# EAGLE design battery-voltage-current-sensor (EAGLE 9.6.2)
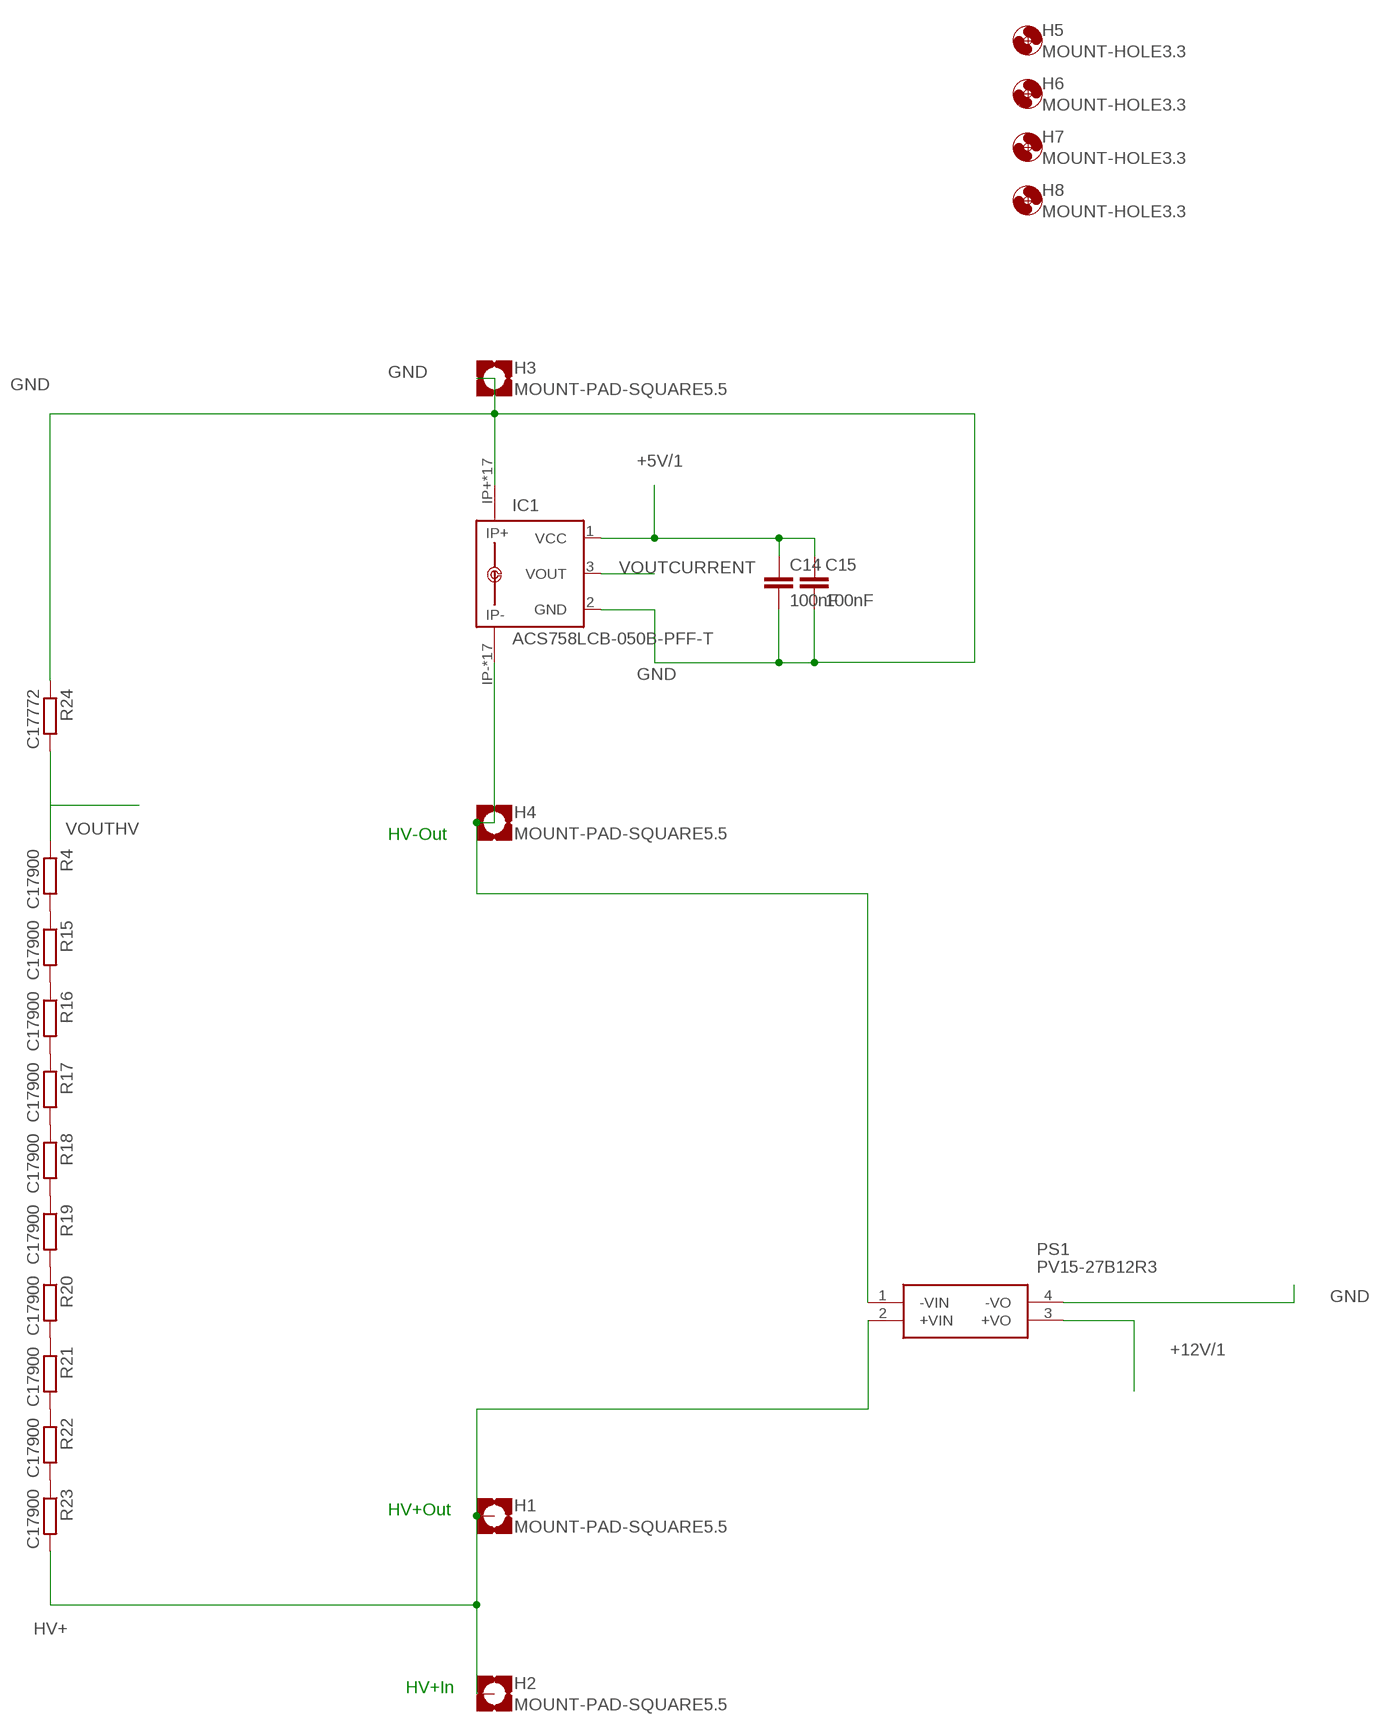
[diagram p0: schematic, sheet 1, part 1 of 2]
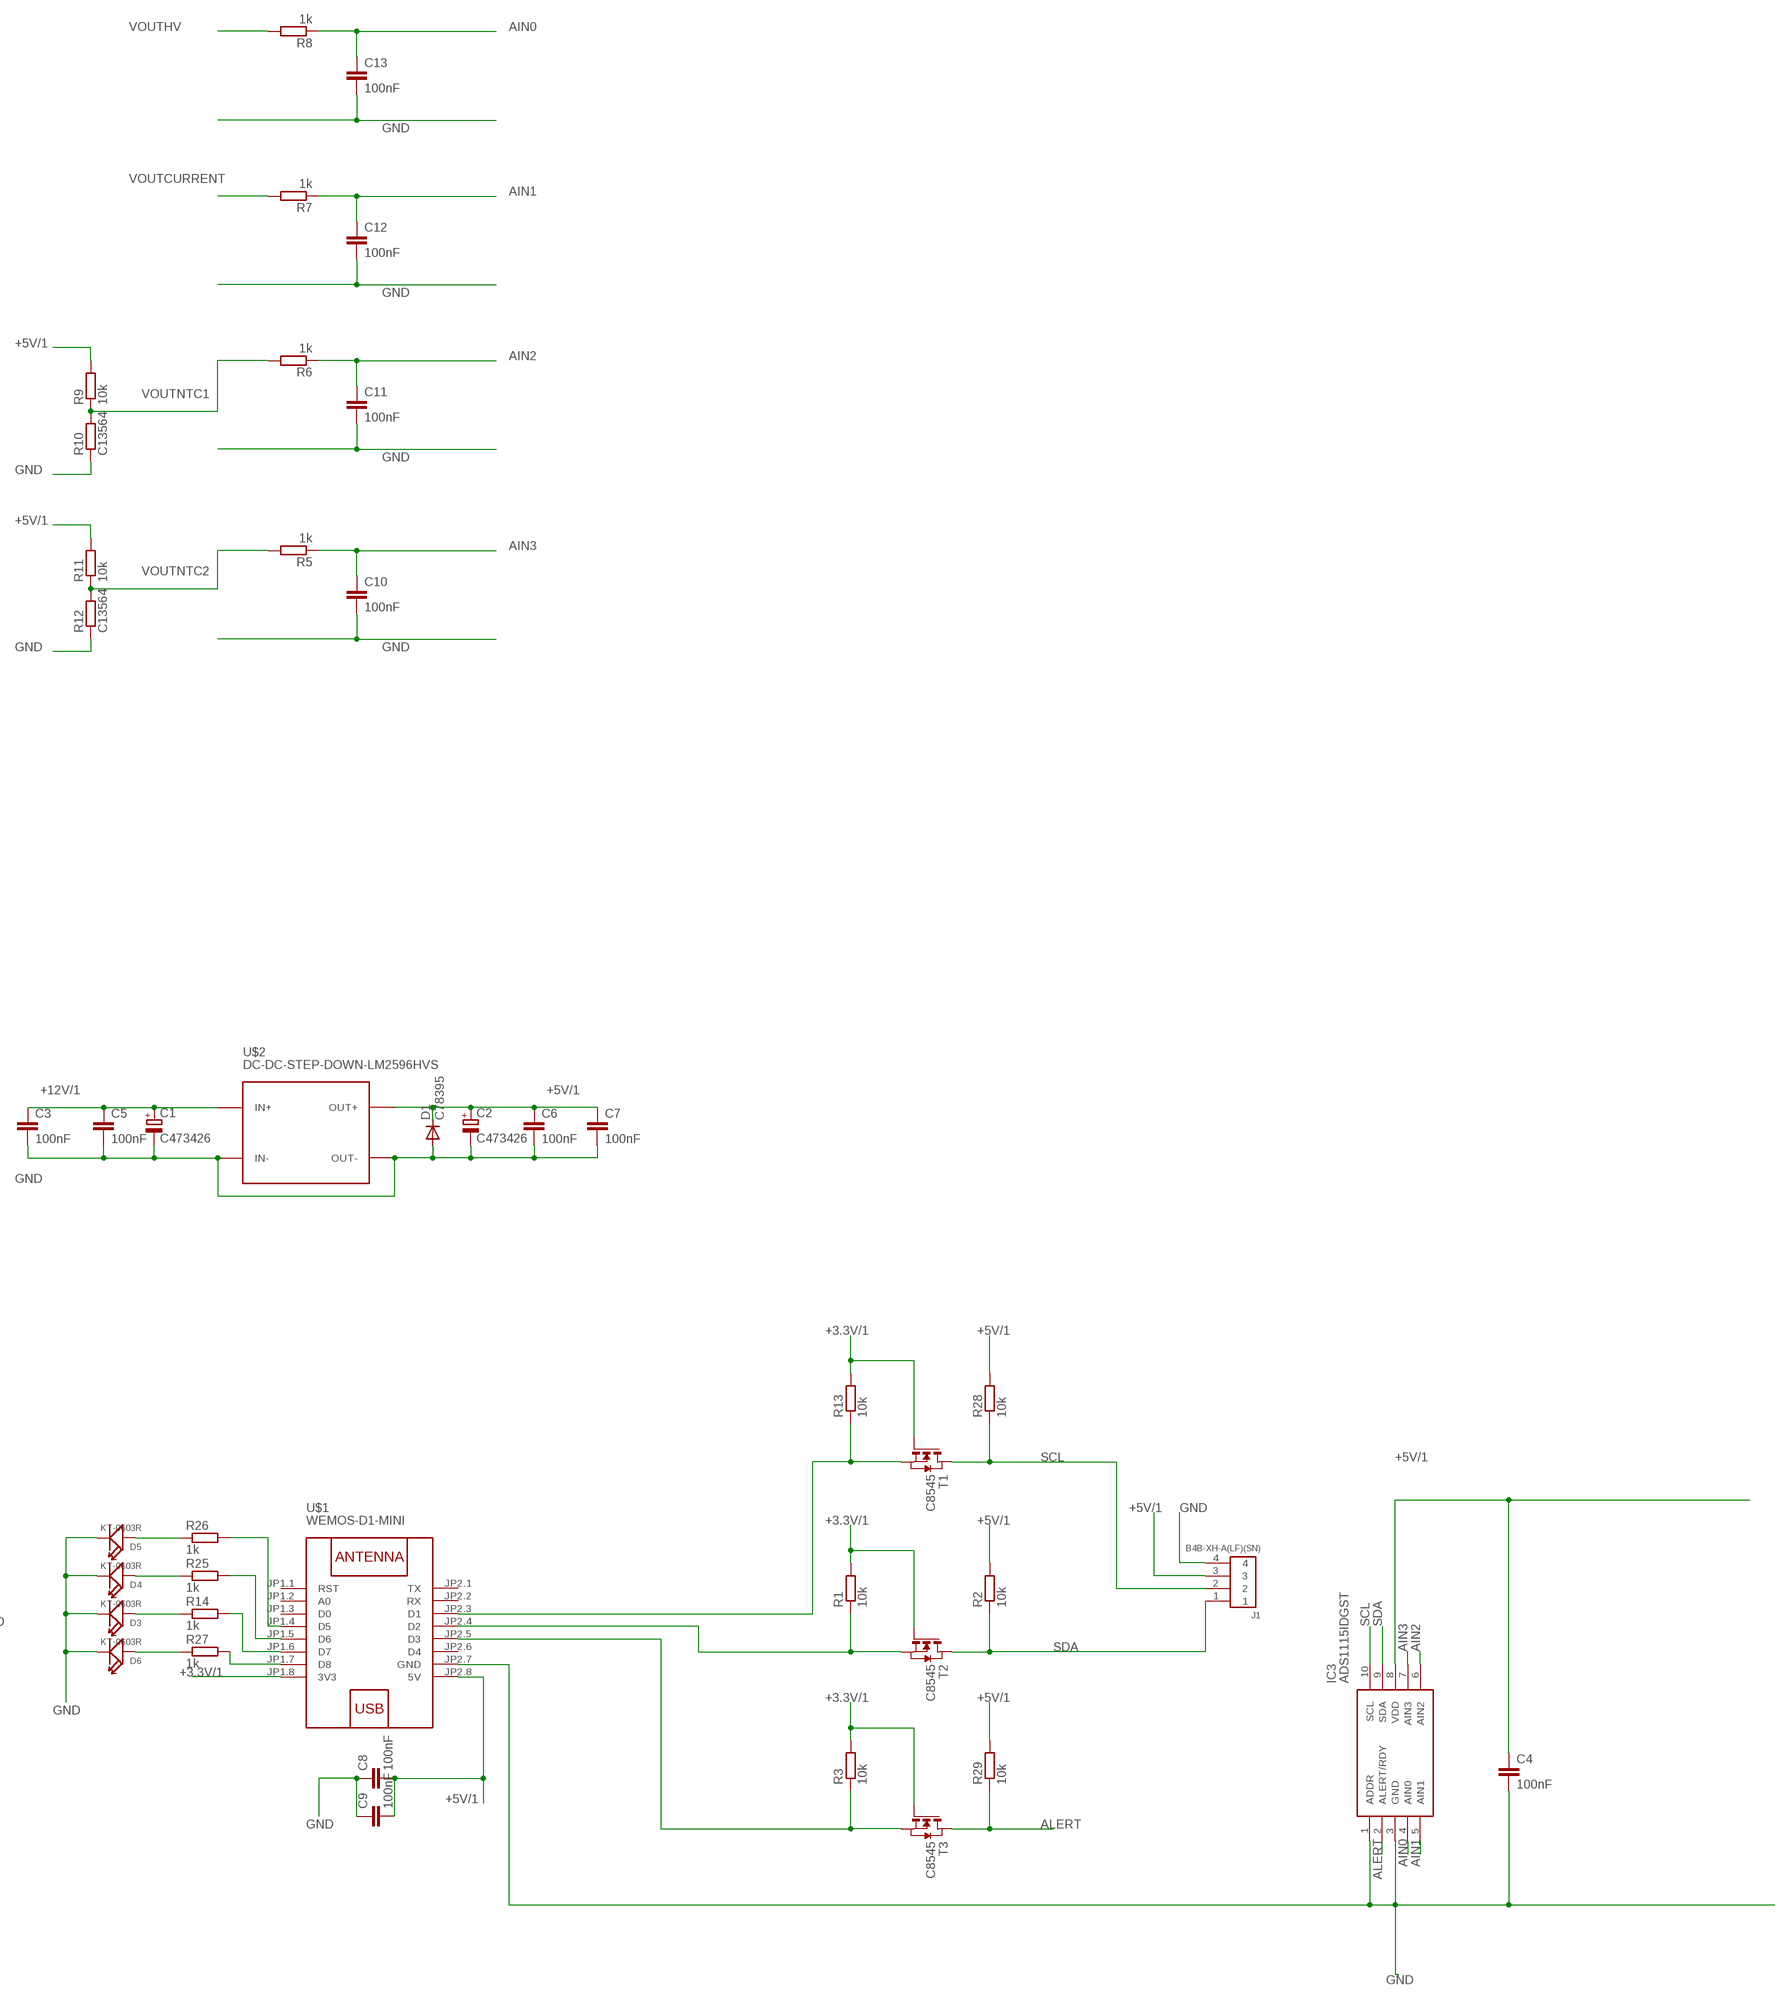
[diagram p1: schematic, sheet 1, part 2 of 2]

## Parts
C1  C473426  CPOL-EUUD-6,3X7,7  [UD-6,3X7,7_NICHICON]
C2  C473426  CPOL-EUUD-6,3X7,7  [UD-6,3X7,7_NICHICON]
C3  100nF  C-EUC0603  [C0603]
C4  100nF  C-EUC0805  [C0805]
C5  100nF  C-EUC0603  [C0603]
C6  100nF  C-EUC0603  [C0603]
C7  100nF  C-EUC0603  [C0603]
C8  100nF  C-EUC0603  [C0603]
C9  100nF  C-EUC0603  [C0603]
C10  100nF  C-EUC0603  [C0603]
C11  100nF  C-EUC0603  [C0603]
C12  100nF  C-EUC0603  [C0603]
C13  100nF  C-EUC0603  [C0603]
C14  100nF  C-EUC0603  [C0603]
C15  100nF  C-EUC0603  [C0603]
D1  C78395  DIODE-SMB  [SMB]
D3  KT-0603R  SMD-LED-CLEAR-BLUE(0603)  [LED-0603]
D4  KT-0603R  SMD-LED-CLEAR-BLUE(0603)  [LED-0603]
D5  KT-0603R  SMD-LED-CLEAR-BLUE(0603)  [LED-0603]
D6  KT-0603R  SMD-LED-CLEAR-BLUE(0603)  [LED-0603]
H1  MOUNT-PAD-SQUARE5.5  [5,5-PAD-SQUARE]
H2  MOUNT-PAD-SQUARE5.5  [5,5-PAD-SQUARE]
H3  MOUNT-PAD-SQUARE5.5  [5,5-PAD-SQUARE]
H4  MOUNT-PAD-SQUARE5.5  [5,5-PAD-SQUARE]
H5  MOUNT-HOLE3.3  [3,3]
H6  MOUNT-HOLE3.3  [3,3]
H7  MOUNT-HOLE3.3  [3,3]
H8  MOUNT-HOLE3.3  [3,3]
IC1  ACS758LCB-050B-PFF-T  [CB-PFF]
IC3  ADS1115IDGST  [SOP50P490X110-10N]
J1  B4B-XH-A(LF)(SN)  [B4B-XH-A(LF)(SN)]
PS1  PV15-27B12R3  [PV1527B12R3]
R1  10k  R-EU_R0603  [R0603]
R2  10k  R-EU_R0603  [R0603]
R3  10k  R-EU_R0603  [R0603]
R4  C17900  R-EU_R1206  [R1206]
R5  1k  R-EU_R0805  [R0805]
R6  1k  R-EU_R0805  [R0805]
R7  1k  R-EU_R0805  [R0805]
R8  1k  R-EU_R0805  [R0805]
R9  10k  R-EU_R0603  [R0603]
R10  C13564  R-EU_R0603  [R0603]
R11  10k  R-EU_R0603  [R0603]
R12  C13564  R-EU_R0603  [R0603]
R13  10k  R-EU_R0603  [R0603]
R14  1k  R-EU_R0805  [R0805]
R15  C17900  R-EU_R1206  [R1206]
R16  C17900  R-EU_R1206  [R1206]
R17  C17900  R-EU_R1206  [R1206]
R18  C17900  R-EU_R1206  [R1206]
R19  C17900  R-EU_R1206  [R1206]
R20  C17900  R-EU_R1206  [R1206]
R21  C17900  R-EU_R1206  [R1206]
R22  C17900  R-EU_R1206  [R1206]
R23  C17900  R-EU_R1206  [R1206]
R24  C17772  R-EU_R0805  [R0805]
R25  1k  R-EU_R0805  [R0805]
R26  1k  R-EU_R0805  [R0805]
R27  1k  R-EU_R0805  [R0805]
R28  10k  R-EU_R0603  [R0603]
R29  10k  R-EU_R0603  [R0603]
T1  C8545  NMOSSOT23  [SOT-23]
T2  C8545  NMOSSOT23  [SOT-23]
T3  C8545  NMOSSOT23  [SOT-23]
U$1  WEMOS-D1-MINI  [WEMOS-D1-MINI]
U$2  DC-DC-STEP-DOWN-LM2596HVS  [DC-DC-STEP-DOWN-LM2596HVS]

## Nets
+3.3V/1: R1.2 R3.2 R13.2 T1.3(G) T2.3(G) T3.3(G) U$1.JP1.8(3V3)
+5V/1: C2.+ C4.1 C6.1 C7.1 C8.2 C9.2 C14.1 C15.1 D1.C IC1.1(VCC) IC3.8(VDD) J1.3 R2.2 R9.2 R11.2 R28.2 R29.2 U$1.JP2.8(5V) U$2.OUT+
+12V/1: C1.+ C3.1 C5.1 PS1.3(+VO) U$2.IN+
AIN0: C13.1 IC3.4(AIN0) R8.1
AIN1: C12.1 IC3.5(AIN1) R7.1
AIN2: C11.1 IC3.6(AIN2) R6.1
AIN3: C10.1 IC3.7(AIN3) R5.1
ALERT: IC3.2(ALERT/RDY) R29.1 T3.1(D)
GND: C1.- C2.- C3.2 C4.2 C5.2 C6.2 C7.2 C8.1 C9.1 C10.2 C11.2 C12.2 C13.2 C14.2 C15.2 D1.A D3.- D4.- D5.- D6.- H3.B5,5(MOUNT) IC1.2(GND) IC1.IP+ IC1.IP+@2(IP+) IC1.IP+@3(IP+) IC1.IP+@4(IP+) IC1.IP+@5(IP+) IC1.IP+@6(IP+) IC1.IP+@7(IP+) IC1.IP+@8(IP+) IC1.IP+@9(IP+) IC1.IP+@10(IP+) IC1.IP+@11(IP+) IC1.IP+@12(IP+) IC1.IP+@13(IP+) IC1.IP+@14(IP+) IC1.IP+@15(IP+) IC1.IP+@16(IP+) IC1.IP+@17(IP+) IC3.1(ADDR) IC3.3(GND) J1.4 PS1.4(-VO) R10.1 R12.1 R24.1 U$1.JP2.7(GND) U$2.IN- U$2.OUT-
HV+ [HV]: H1.B5,5(MOUNT) H2.B5,5(MOUNT) PS1.2(+VIN) R23.2
HV- [HV]: H4.B5,5(MOUNT) IC1.IP- IC1.IP-@2(IP-) IC1.IP-@3(IP-) IC1.IP-@4(IP-) IC1.IP-@5(IP-) IC1.IP-@6(IP-) IC1.IP-@7(IP-) IC1.IP-@8(IP-) IC1.IP-@9(IP-) IC1.IP-@10(IP-) IC1.IP-@11(IP-) IC1.IP-@12(IP-) IC1.IP-@13(IP-) IC1.IP-@14(IP-) IC1.IP-@15(IP-) IC1.IP-@16(IP-) IC1.IP-@17(IP-) PS1.1(-VIN)
N$1: R1.1 T2.2(S) U$1.JP2.4(D2)
N$2: R13.1 T1.2(S) U$1.JP2.3(D1)
N$3: D3.+ R14.1
N$5: R3.1 T3.2(S) U$1.JP2.5(D3)
N$6: D4.+ R25.1
N$7: D5.+ R26.1
N$8: R4.2 R15.1
N$9: R15.2 R16.1
N$10: R16.2 R17.1
N$11: R17.2 R18.1
N$12: R18.2 R19.1
N$13: R19.2 R20.1
N$14: R20.2 R21.1
N$15: R21.2 R22.1
N$16: R22.2 R23.1
N$17: D6.+ R27.1
N$18: R27.2 U$1.JP1.7(D8)
N$19: R14.2 U$1.JP1.6(D7)
N$20: R25.2 U$1.JP1.5(D6)
N$21: R26.2 U$1.JP1.4(D5)
SCL: IC3.10(SCL) J1.2 R28.1 T1.1(D)
SDA: IC3.9(SDA) J1.1 R2.1 T2.1(D)
VOUTCURRENT: IC1.3(VOUT) R7.2
VOUTHV: R4.1 R8.2 R24.2
VOUTNTC1: R6.2 R9.1 R10.2
VOUTNTC2: R5.2 R11.1 R12.2
Unconnected: U$1.JP1.1(RST) U$1.JP1.2(A0) U$1.JP1.3(D0) U$1.JP2.1(TX) U$1.JP2.2(RX) U$1.JP2.6(D4)

## Notes on the sheet
- HV-Out
- HV+Out
- HV+In

## Library data of the parts
C1 C2 = rcl:CPOL-EU: POLARIZED CAPACITOR, European symbol
C3-C15 = rcl:C-EU: CAPACITOR, European symbol
D1 = diode:DIODE-: DIODE
D3-D6 = SMD-LED-CLEAR-BLUE_0603_:SMD-LED-CLEAR-BLUE(0603): 304090045 Check prices <https://pricing.snapeda.com/parts/19-217/BHC-ZL1M2RY/3T/Everlight/view-part?ref=eda>; AVAILABILITY: Bad; DESCRIPTION: Blue LED Indication - Discrete 2.8V 0603 (1608 Metric); MF: Everlight; MP: 19-217/BHC-ZL1M2RY/3T; PACKAGE: 0603 Everlight; PRICE: None
H1-H4 = holes:MOUNT-PAD-SQUARE: MOUNTING PAD, square
H5-H8 = holes:MOUNT-HOLE: MOUNTING HOLE with drill center marker
IC1 = allegro:ACS758*: Thermally Enhanced, Fully Integrated, Hall Effect-Based Linear Current Sensor with 100 micro Ohm Current Conductor display layer 49 Reference in BRD and place VIAs on circles Source: http://www.allegromicro.com/en/Products/Part_Numbers/0758/0758.pdf; MPN: ACS758LCB-050B-PFF-T; OC_FARNELL: 1718997; OC_NEWARK: 04R7131
IC3 = SamacSys_Parts:ADS1115IDGST: 16-Bit, 860SPS, 4-Ch Delta-Sigma ADC w/ PGA, Oscillator, Voltage Reference, Comparator & I2C Source: Datasheet <https://datasheet.datasheetarchive.com/originals/distributors/Datasheets-SFU2/DSASFU100025989.pdf>; DESCRIPTION: 16-Bit, 860SPS, 4-Ch Delta-Sigma ADC w/ PGA, Oscillator, Voltage Reference, Comparator & I2C; HEIGHT: 1.1mm; MANUFACTURER_NAME: Texas Instruments; MANUFACTURER_PART_NUMBER: ADS1115IDGST; MOUSER_PART_NUMBER: 595-ADS1115IDGST; MOUSER_PRICE-STOCK: https://www.mouser.co.uk/ProductDetail/Texas-Instruments/ADS1115IDGST?qs=6805eV47HhY3JIwOhQ2zog%3D%3D
J1 = Headers:B4B-XH-A(LF)(SN): CONN HEADER VERT 4POS 2.5MM Manufacturer's datasheet <http://www.jst-mfg.com/product/pdf/eng/eXH.pdf>; CREATED_BY: PCBLayout.com; DIGIKEY_PARTNO: 455-2249-ND; MANUFACTURER: JST Sales America Inc.; MPN: B4B-XH-A(LF)(SN)
PS1 = SamacSys_Parts:PV15-27B12R3: Isolated Module DC DC Converter 1 Output 12V 1.25A 100V - 1000V Input Source: Datasheet <https://www.mornsun-power.com/html/pdf/PV15-27B12R3.html>; DESCRIPTION: Isolated Module DC DC Converter 1 Output 12V 1.25A 100V - 1000V Input; HEIGHT: 24mm; MANUFACTURER_NAME: Mornsun Power; MANUFACTURER_PART_NUMBER: PV15-27B12R3
R1-R29 = rcl:R-EU_: RESISTOR, European symbol
T1-T3 = zetex:NMOSSOT23: MOS FET; OC_FARNELL: unknown; OC_NEWARK: unknown
U$1 = diy-modules:WEMOS-D1-MINI: WEMOS D1 mini: Mini Wi-Fi Board based on ESP-8266 device More details can be found here: https://www.wemos.cc/product/d1-mini.html Click here to find device on ebay.com <http://www.ebay.com/sch/wemos+d1+mini+nodemcu>
U$2 = diy-modules:DC-DC-STEP-DOWN-LM2596HVS: DC/DC Step-Down Regulator based on LM2596-ADJ chip LM2596 datasheet available here: http://www.ti.com/lit/ds/symlink/lm2596.pdf Click here to find device on ebay.com <http://www.ebay.com/sch/lm2596+power+regulator>

## Net classes
1 HV: clearance 0.508 mm

## Board
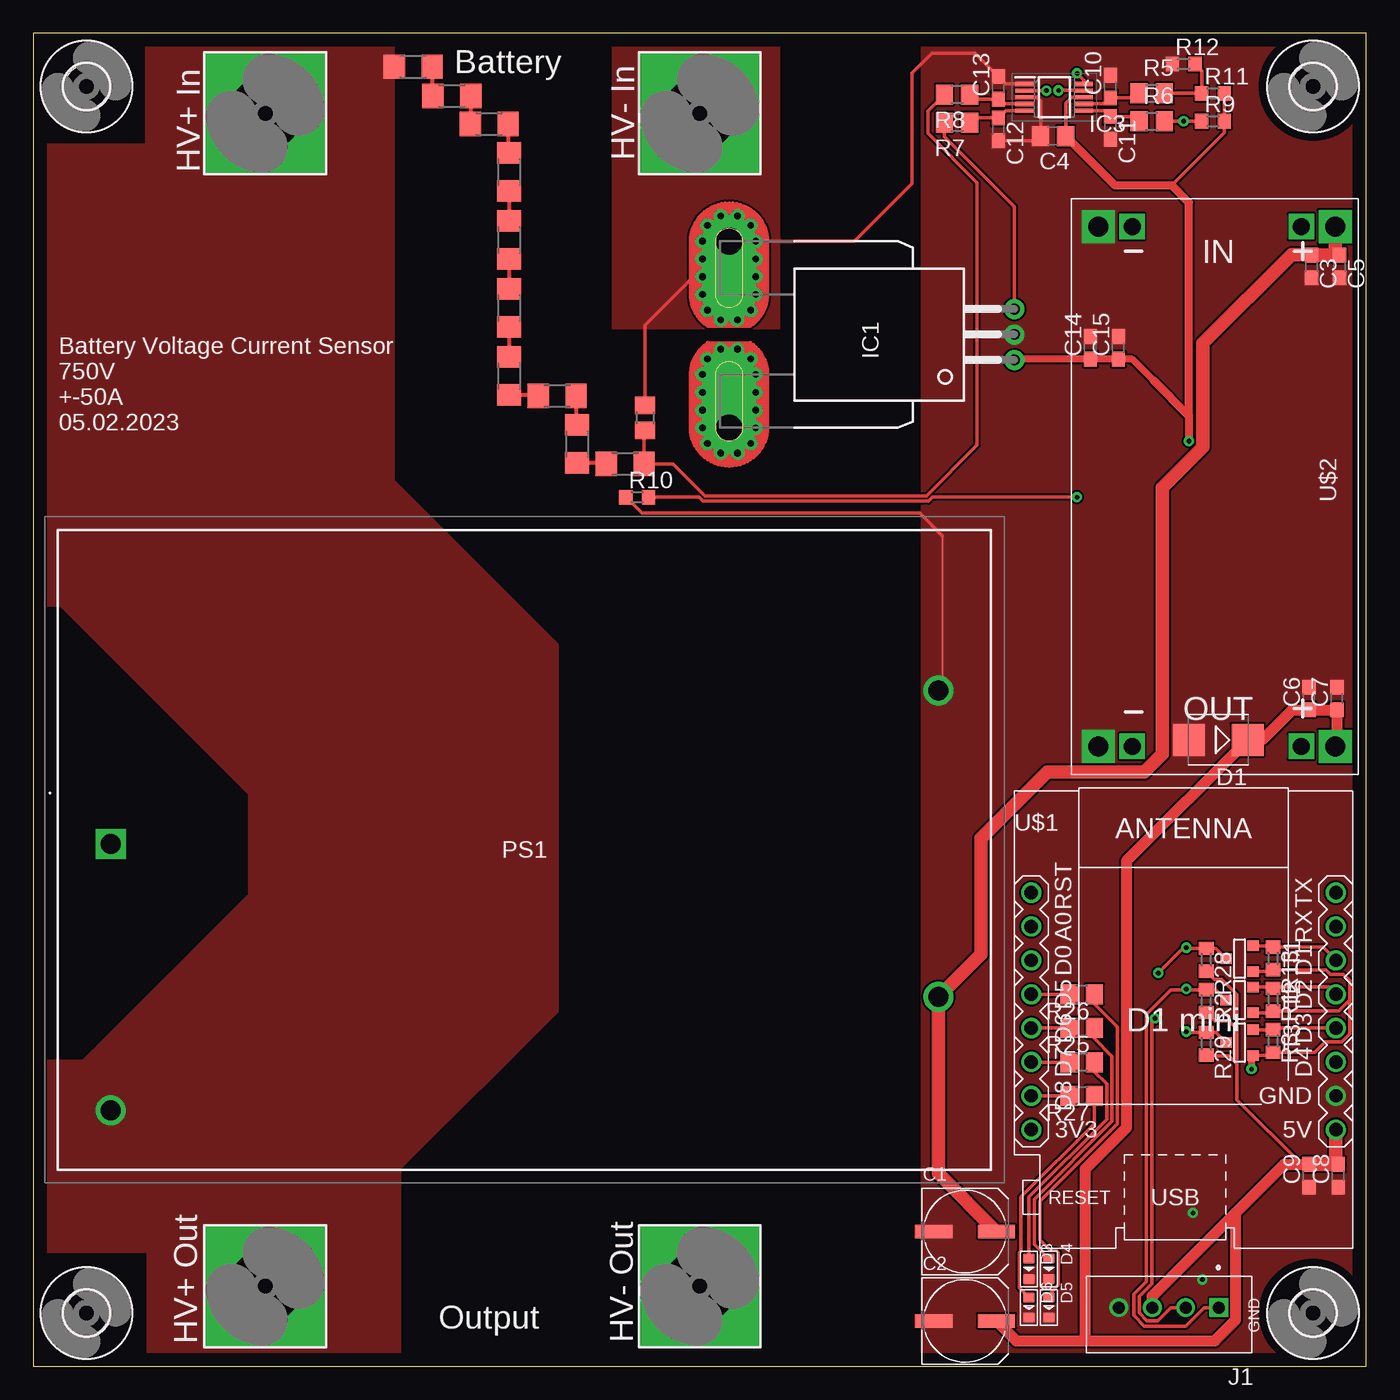
[diagram p2: board, top side]
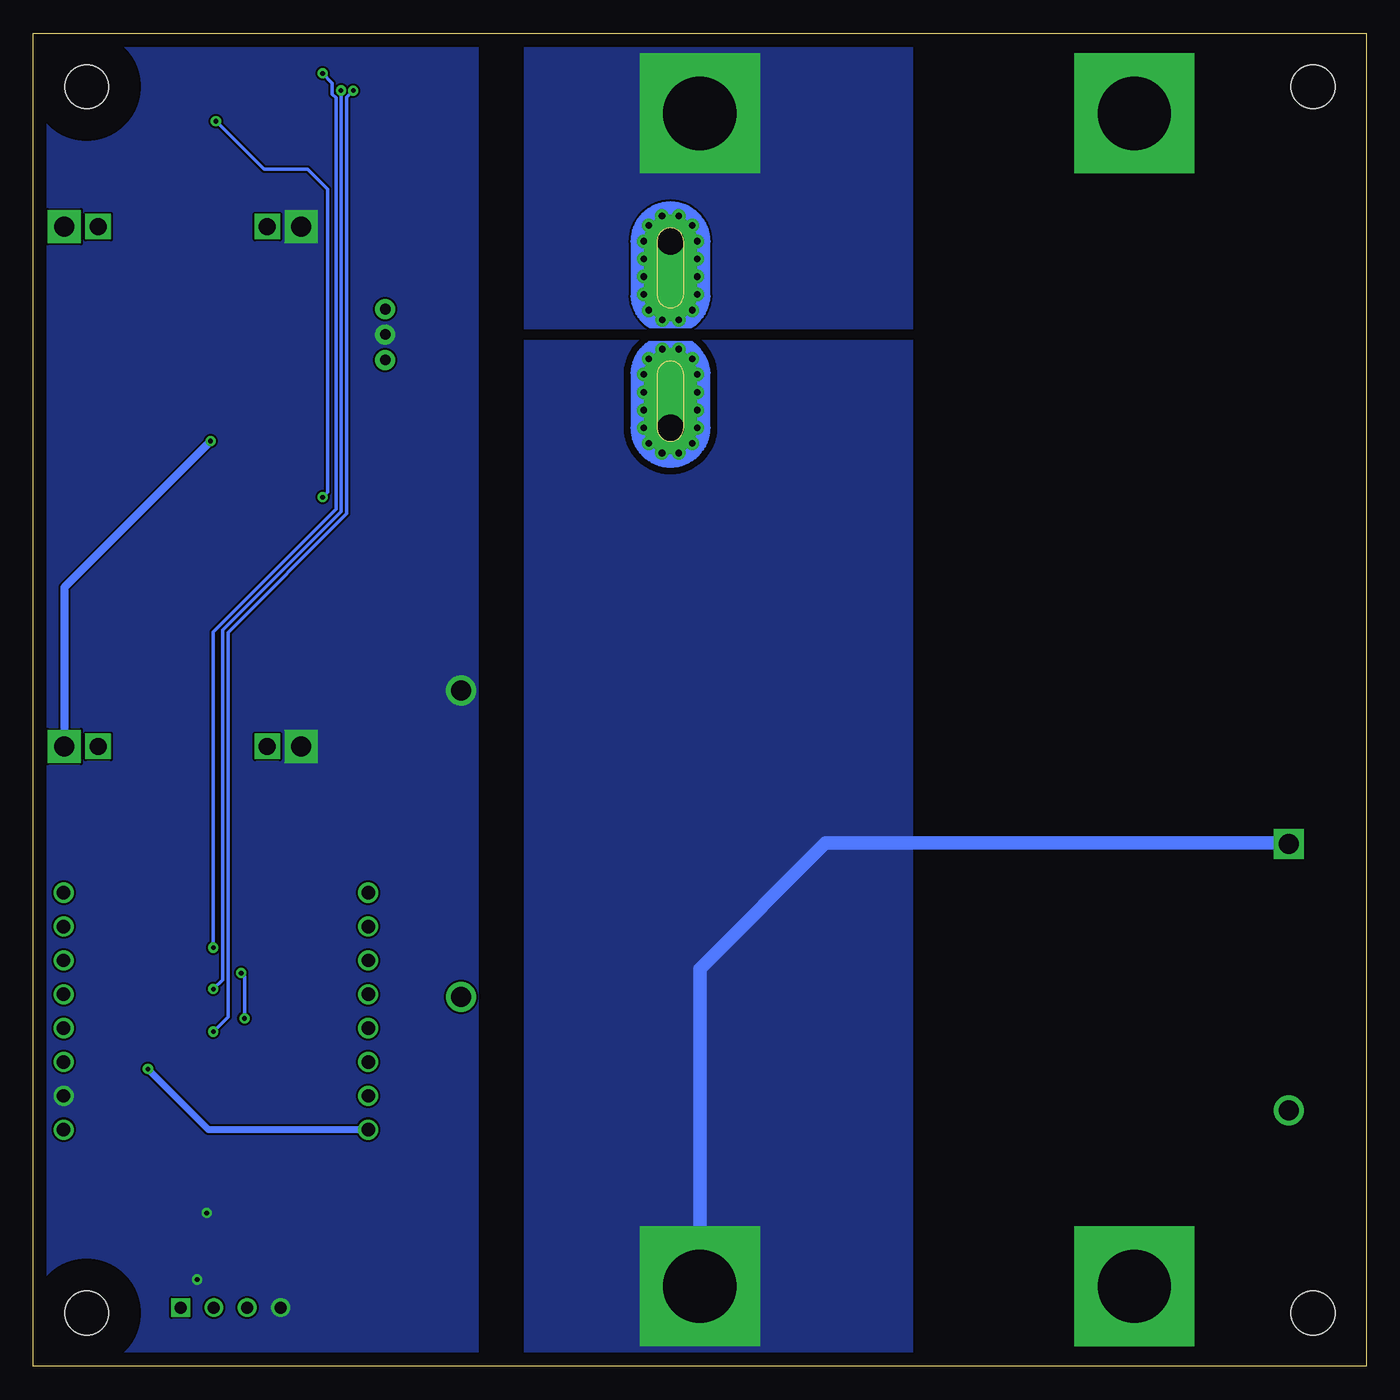
[diagram p3: board, bottom side, seen from below]

Size 100 x 100 mm. Coordinates in mm from the lower left corner, seen from the top.
Outline: 0,0 100,0 100,100 0,100 0,0
Copper layers (1*16): Top 0.035mm / dielectric 1.5mm / Bottom 0.035mm
Design rules "default": minimum track width 6mil, minimum drill 0.35mm, track to track 6mil, track to pad 6mil, pad to pad 6mil, via to via 6mil, smd to smd 6mil, copper to edge 40mil, drill to drill 6mil, minimum pad ring 10mil, minimum via ring 8mil, stop-mask expansion 4mil, vias tented up to drill 0mil, thermal gap 10mil
tKeepout: area 159,-14.1 to 169,105.9
tRestrict: area 125.9,-14.1 to 135.9,105.9; area -70,86 to -60,149; area -4.4,29.2 to 15.6,49.2
bRestrict: area 142.7,-14.8 to 152.7,105.2; area 23.8,-81.4 to 33.8,38.6; area 23.8,39.9 to 33.8,159.9

### Footprints (pad centres in the part's own frame; a part is rotated, then mirrored left to right if it is on the bottom)
UD-6,3X7,7_NICHICON = smd 2.8 x 1: + 2.35,0; - -2.35,0
C0603 = smd 1.1 x 1: 1 -0.85,0; 2 0.85,0
C0805 = smd 1.3 x 1.5: 1 -0.95,0; 2 0.95,0
SMB = smd 2.4 x 2.4: A 2.2,0; C -2.2,0
LED-0603 = smd 0.762 x 0.889: + -0.762,0; - 0.762,0
5,5-PAD-SQUARE = drill 5.5 pad 9 square: B5,5 0,0
3,3 = hole 3.3: 0,0
CB-PFF = drill 0.8 pad 1.5: 1 -1.91,-21.4; 2 0,-21.4; 3 1.91,-21.4 | drill 2 pad 4 offset: IP+ 7,0; IP- -7,0 | drill 0.5 pad 0.9: IP+@2 8.89,0.635; IP+@3 8.89,-0.635; IP+@4 8.175,-1.625; IP+@5 7,-2; IP+@6 5.675,-2; IP+@7 4.35,-2; IP+@8 3,-2; IP+@9 1.825,-1.625; IP+@10 1.1,-0.625; IP+@11 1.1,0.625; IP+@12 1.825,1.625; IP+@13 3,2; IP+@14 4.35,2; IP+@15 5.675,2; IP+@16 7,2; IP+@17 8.175,1.625; IP-@2 -8.89,0.635; IP-@3 -8.89,-0.635; IP-@4 -8.175,-1.625; IP-@5 -7,-2; IP-@6 -5.675,-2; IP-@7 -4.325,-2; IP-@8 -3,-2; IP-@9 -1.825,-1.625; IP-@10 -1.1,-0.625; IP-@11 -1.1,0.625; IP-@12 -1.825,1.625; IP-@13 -3,2; IP-@14 -4.325,2; IP-@15 -5.675,2; IP-@16 -7,2; IP-@17 -8.175,1.625
SOP50P490X110-10N = smd 1.4 x 0.3: 1 -2.2,1; 2 -2.2,0.5; 3 -2.2,0; 4 -2.2,-0.5; 5 -2.2,-1; 6 2.2,-1; 7 2.2,-0.5; 8 2.2,0; 9 2.2,0.5; 10 2.2,1
B4B-XH-A(LF)(SN) = drill 0.9 square: 1 -3.75,0 | drill 0.9: 2 -1.25,0; 3 1.25,0; 4 3.75,0
PV1527B12R3 = drill 1.5 pad 2.25 square: 1 0,-3.81 | drill 1.5 pad 2.25: 2 0,-23.81; 3 62.09,-15.31; 4 62.09,7.69
R0603 = smd 1 x 1.1: 1 -0.85,0; 2 0.85,0
R1206 = smd 1.6 x 1.803: 1 -1.422,0; 2 1.422,0
R0805 = smd 1.3 x 1.5: 1 -0.95,0; 2 0.95,0
SOT-23 = smd 0.787 x 0.889: 1 0.025,-1.016; 2 -0.94,1.016; 3 0.991,1.016
WEMOS-D1-MINI = drill 1: JP1.1 -11.43,9.525; JP1.2 -11.43,6.985; JP1.3 -11.43,4.445; JP1.4 -11.43,1.905; JP1.5 -11.43,-0.635; JP1.6 -11.43,-3.175; JP1.7 -11.43,-5.715; JP1.8 -11.43,-8.255; JP2.1 11.43,9.525; JP2.2 11.43,6.985; JP2.3 11.43,4.445; JP2.4 11.43,1.905; JP2.5 11.43,-0.635; JP2.6 11.43,-3.175; JP2.7 11.43,-5.715; JP2.8 11.43,-8.255
DC-DC-STEP-DOWN-LM2596HVS = drill 1.5 pad 2.5 square: IN+ 0,17.78; IN- 0,0; OUT+ 39,17.78; OUT- 39,0 | drill 1.27 pad 1.676 square: P$1 0,15.24; P$6 0,2.54; P$7 39,15.24; P$8 39,2.54

### Placement (x,y rotation side)
C1  69.9,10.1 0 top
C2  69.9,3.4 0 top
C3  95.9,82.5 270 top
C4  76.5,92.3 180 top
C5  98,82.5 270 top
C6  95.7,50.1 90 top
C7  97.8,50.1 90 top
C8  97.9,14.3 90 top
C9  95.7,14.3 90 top
C10  80.8,96 90 top
C11  80.8,92.9 270 top
C12  72.4,92.8 270 top
C13  72.4,95.9 90 top
C14  79.3,76.4 90 top
C15  81.4,76.4 90 top
D1  88.9,47 180 top
D3  74.7,7.3 270 top
D4  76.2,7.3 270 top
D5  76.2,4.4 270 top
D6  74.7,4.4 270 top
H1  17.4,6 0 top
H2  17.4,94 0 top
H3  50,94 0 top
H4  50,6 0 top
H5  4,4 0 top
H6  4,96 0 top
H7  96,4 0 top
H8  96,96 0 top
IC1  52.2,77.4 90 top
IC3  76.6,95.2 0 top
J1  85.2,4.4 180 top
PS1  5.8,43 0 top
R1  93,27.5 270 top
R2  88,27.4 270 top
R3  93,24.4 270 top
R4  44.4,67.7 180 top
R5  83.9,95.5 0 top
R6  83.9,93.4 0 top
R7  69.3,93.3 180 top
R8  69.3,95.4 180 top
R9  88.5,93.4 0 top
R10  45.3,65.2 0 top
R11  88.5,95.5 0 top
R12  86.3,97.7 0 top
R13  93,30.6 270 top
R14  78.65,22.8 180 top
R15  40.8,69.2 90 top
R16  39.3,72.8 180 top
R17  35.7,74.3 90 top
R18  35.7,79.4 90 top
R19  35.7,84.5 90 top
R20  35.7,89.6 90 top
R21  34.2,93.2 180 top
R22  31.4,95.3 180 top
R23  28.5,97.5 180 top
R24  45.9,71.15 270 top
R25  78.65,25.4 180 top
R26  78.65,27.9 180 top
R27  78.65,20.3 180 top
R28  88,30.5 270 top
R29  88,24.2 270 top
T1  90.5,30.6 270 top
T2  90.5,27.5 270 top
T3  90.5,24.3 270 top
U$1  86.3,26 0 top
U$2  79.9,85.5 270 top

### Tracks (layer width: path | path; a pad name or v marks a point on that pad's centre or on a via)
+3.3V/1  (via drill 0.35)
  Top 0.254: T1.3 92.86,29.61 R13.2 96.96,29.75 97.3,29.41 98.29,29.41 98.76,28.94 98.76,27.48 | T2.3 92.86,26.51 R1.2 97.94,26.65 98.76,27.48 | T3.3 91.6,23.31 92.76,23.31 R3.2 96.15,23.55 96.93,24.33 98.16,24.33 98.76,24.94 98.76,27.48
  Top 0.508: v91.4,22.3 91.4,23.11 91.6,23.31
  Bottom 0.508: U$1.JP1.8 86.84,17.75 v91.4,22.3
+5V/1  (via drill 0.35)
  Top 0.254: IC3.8 77.9,95.2 77.45,94.75 C4.1 | 85.4,88.6 89.35,92.55 R9.2 R11.2 | R28.2 88.62,29.03 89.16,29.03 90.3,27.89 90.3,25.3 | 90.3,25.3 90.3,22.7 | 90.3,22.7 90.3,20 95.15,15.15 C9.2 | R2.2 88.65,25.9 89.7,25.9 90.3,25.3 | R29.2 88.05,23.3 89.7,23.3 90.3,22.7
  Top 0.508: 84.05,73.95 82.45,75.55 C15.1 C14.1 73.66,75.55 IC1.1
  Top 0.61: C4.1 81.15,88.6 85.4,88.6 86.7,87.3 86.7,71.3 | 86.7,71.3 84.05,73.95 | 86.7,71.3 v86.7,69.4
  Top 0.813: U$2.OUT+ 97.8,46.62 C7.1 C6.1 94.45,49.25 92.2,47 D1.C 82.03,37.93 82.03,17.91 78.9,14.78 78.9,1.9 | C2.+ 73.75,1.9 78.9,1.9 | C9.2 93.85,15.15 90.45,11.75 90.21,11.51 | J1.3 83.95,5.25 90.21,11.51 | 78.9,1.9 88.65,1.9 90.21,3.46 90.21,11.51
  Top 1.016: C9.2 C8.2 97.73,15.32 U$1.JP2.8
  Bottom 0.61: v86.7,69.4 97.68,58.42 U$2.OUT+
+12V/1
  Top 1.016: U$2.IN+ 97.68,83.67 C5.1 C3.1 95.85,83.4 94.4,83.4 87.74,76.74 87.74,68.97 84.7,65.93 84.7,45.92 83.37,44.59 76.09,44.59 71.1,39.6 71.1,30.9 PS1.3 67.89,14.46 C1.+
AIN0
  Top 0.254: IC3.4 72.75,94.7 C13.1 70.6,95.05 R8.1
AIN1
  Top 0.254: IC3.5 72.95,94.2 C12.1 70.6,93.65 R7.1
AIN2
  Top 0.254: IC3.6 80.35,94.2 C11.1 82.6,93.75 R6.1
AIN3
  Top 0.254: IC3.7 80.35,94.7 C10.1 82.6,95.15 R5.1
ALERT  (via drill 0.35)
  Top 0.254: T3.1 88.71,25.05 R29.1 86.55,25.05 v86.5,25.1 | v76,95.7 IC3.2
  Bottom 0.254: v86.5,25.1 85.39,26.21 85.39,55.06 76.49,63.96 76.49,95.21 v76,95.7
GND  (via drill 0.35)
  Top 0.152: 68.2,62.3 68.2,51 PS1.4
  Top 0.254: IC3.3 75.3,95.2 75.6,94.9 75.6,92.35 C4.2 75.2,91.95 C12.2 | IC3.1 72.95,96.2 C13.2 70.65,98.5 67.4,98.5 65.9,97 65.9,88.7 61.6,84.4 IC1.IP+ 45.9,78.1 R24.1 | R10.1 45.65,64 66.5,64 68.2,62.3
  other vias: 87,11.5 87.7,6.5
  pour Top (no thermals): 66.6,100.5 100.4,100.5 100.4,-1 66.6,-1
  pour Bottom (no thermals): 66.6,100.1 100.1,100.1 100.1,-0.1 66.6,-0.1
  pour Bottom (no thermals): 63.2,100 34,100 34,77.8 63.2,77.8
  pour Top (no thermals): 43.4,102 43.4,77.8 56,77.8 56,102
HV+
  pour Top (no thermals): -0.1,91.7 8.4,91.7 8.4,100.1 27.1,100.1 27.1,66.5 39.4,54.2 39.4,26.6 27.6,14.8 27.6,-0.1 8.5,-0.1 8.5,8.5 -0.1,8.5 -0.1,23 3.7,23 16.1,35.4 16.1,42.9 2,57 -0.1,57
HV-
  Bottom 1.016: H4.B5,5 50,29.8 40.56,39.24 5.85,39.24 PS1.1
  pour Bottom (no thermals): 63.2,77 34,77 34,0 63.2,0
N$1
  Top 0.254: T2.2 92.91,28.44 | 92.91,28.44 R1.1 | U$1.JP2.4 97.19,28.44 92.91,28.44
N$2
  Top 0.254: T1.2 92.91,31.54 R13.1 96.72,31.45 U$1.JP2.3
N$3
  Top 0.254: R14.1 79.6,22.09 80.53,21.17 80.53,18.53 74.7,12.7 D3.+
N$5
  Top 0.254: T3.2 R3.1 93.11,25.36 U$1.JP2.5
N$6
  Top 0.254: R25.1 79.6,24.59 80.94,23.26 80.94,18.36 75.11,12.53 75.11,9.16 D4.+
N$7
  Top 0.254: R26.1 79.6,27.2 81.34,25.45 81.34,18.19 75.51,12.36 75.51,9.49 76.28,8.72 76.7,8.72 76.92,8.5 76.92,6.1 76.2,5.37 D5.+
N$8
  Top 0.305: R15.1 42.9,67.78 R4.2
N$9
  Top 0.305: R16.1 40.72,70.7 R15.2
N$10
  Top 0.305: R17.1 37.8,72.88 R16.2
N$11
  Top 0.305: R18.1 R17.2
N$12
  Top 0.305: R19.1 R18.2
N$13
  Top 0.305: R20.1 R19.2
N$14
  Top 0.305: R21.1 35.62,91.1 R20.2
N$15
  Top 0.305: R22.1 32.82,93.24 R21.2
N$16
  Top 0.305: R23.1 29.92,95.36 R22.2
N$17
  Top 0.254: R27.1 79.6,18.2 74.1,12.7 74.1,8.63 73.98,8.5 73.98,5.89 D6.+
N$18
  Top 0.254: R27.2 74.89,20.3 U$1.JP1.7
N$19
  Top 0.254: R14.2 74.89,22.8 U$1.JP1.6
N$20
  Top 0.254: R25.2 74.91,25.4 U$1.JP1.5
N$21
  Top 0.254: R26.2 U$1.JP1.4
SCL  (via drill 0.35)
  Top 0.254: T1.1 88.71,31.35 R28.1 86.55,31.35 | 86.55,31.35 v86.5,31.4 | v78.3,97 78.8,96.5 IC3.10 | v84.16,26.1 83.91,25.85 83.91,6.18 82.97,5.24 82.97,3.99 83.54,3.42 84.36,3.42 85.34,4.4 J1.2 | v84.4,29.5 86.25,31.35 86.55,31.35
  Bottom 0.254: v86.5,31.4 86.5,55.1 77.3,64.3 77.3,95.17 77.57,95.44 77.57,96.27 v78.3,97 | v84.16,26.1 84.16,29.26 v84.4,29.5
SDA  (via drill 0.35)
  Top 0.254: T2.1 88.71,28.25 R2.1 86.55,28.25 | 86.55,28.25 v86.5,28.3 | v76.92,95.72 78.78,95.72 IC3.9 | 86.55,28.25 85.35,28.25 83.5,26.4 83.5,6.34 82.56,5.41 82.56,3.82 83.37,3.01 86.45,3.01 87.84,4.4 J1.1
  Bottom 0.254: v86.5,28.3 85.8,29 85.8,55.23 76.89,64.13 76.89,95.69 v76.92,95.72
VOUTCURRENT
  Top 0.254: R7.2 68.35,92.25 73.6,87 IC1.3
VOUTHV
  Top 0.254: R8.2 67.1,94.15 67.1,92.5 70.8,88.8 70.8,69.1 67,65.3 50.4,65.3 48,67.7 R4.1 45.82,70.12 R24.2
VOUTNTC1  (via drill 0.35)
  Top 0.254: R6.2 v86.3,93.4 R9.1 | v78.3,65.2 67.47,65.2 67.17,64.89 50.23,64.89 49.92,65.2 R10.2
  Bottom 0.254: v86.3,93.4 82.7,89.8 79.41,89.8 77.91,88.3 77.91,65.59 v78.3,65.2
VOUTNTC2
  Top 0.254: R5.2 R11.1 87.65,97.2 R12.2

### Text on the board
tNames: Battery | HV+ In | HV- In | Battery Voltage Current Sensor / 750V / +-50A / 05.02.2023 | GND | Output | HV+ Out | HV- Out